# EAGLE design 4th SCHEMATIC_EP (EAGLE 9.6.2)
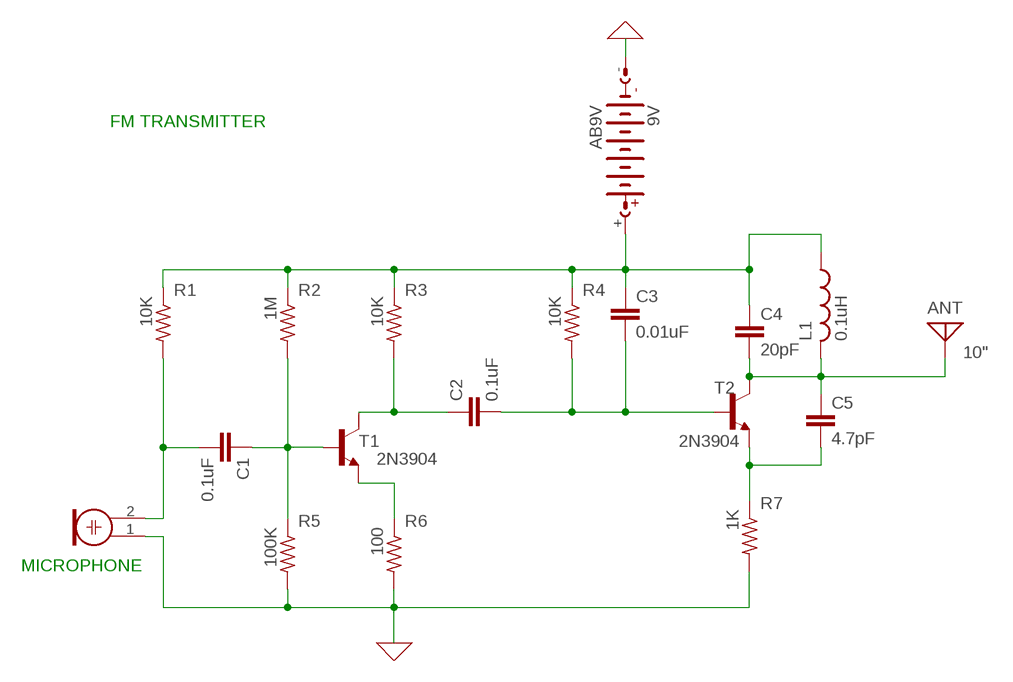
[diagram p0: schematic, sheet 1]

## Parts
9V  AB9V  [AB9V]
ANT  10"  ANTENNA  [PAD-01]
C1  0.1uF  C2.5/2  [C2.5-2]
C2  0.1uF  C2.5/2  [C2.5-2]
C3  0.01uF  C2.5/2  [C2.5-2]
C4  20pF  C2.5/2  [C2.5-2]
C5  4.7pF  C2.5/2  [C2.5-2]
L1  0.1uH  L-US0207/7  [0207/7]
MIC  ELECTRET_MICROPHON-F6050AP  [F6050AP]
R1  10K  R-US_R0603  [R0603]
R2  1M  R-US_R0603  [R0603]
R3  10K  R-US_R0603  [R0603]
R4  10K  R-US_R0603  [R0603]
R5  100K  R-US_R0603  [R0603]
R6  100  R-US_R0603  [R0603]
R7  1K  R-US_R0603  [R0603]
T1  2N3904  [TO92]
T2  2N3904  [TO92]

## Nets
0: 9V.- MIC.1 R5.2 R6.2 R7.2 ; supply symbol labelled GND
N$1: C1.1 R2.2 R5.1 T1.2(B)
N$2: R6.1 T1.3(E)
N$3: C2.1 R3.2 T1.1(C)
N$4: 9V.+ C3.1 C4.1 L1.1 R1.1 R2.1 R3.1 R4.1
N$5: C1.2 MIC.2 R1.2
N$7: C5.2 R7.1 T2.3(E)
N$8: C2.2 C3.2 R4.2 T2.2(B)
N$9: ANT.1 C4.2 C5.1 L1.2 T2.1(C)

## Notes on the sheet
- FM TRANSMITTER
- MICROPHONE

## Library data of the parts
9V = battery:AB9V: 9-V BATTERY CLIP
ANT = discrete:ANTENNA: Antenna
C1-C5 = capacitor-wima:C: CAPACITOR naming: grid - package width
L1 = rcl:L-US: INDUCTOR, American symbol; SPICEPREFIX: L
MIC = microphon:ELECTRET_MICROPHON-: Electret Condenser Microphone
R1-R7 = rcl:R-US_: RESISTOR, American symbol; SPICEPREFIX: R
T1 T2 = transistor:2N3904: NPN TRANSISTOR

## Board
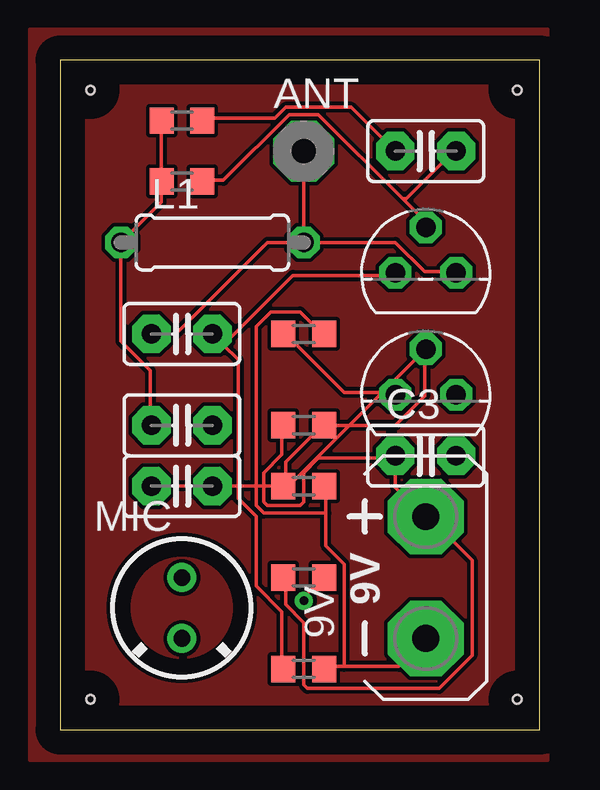
[diagram p1: board, top side]
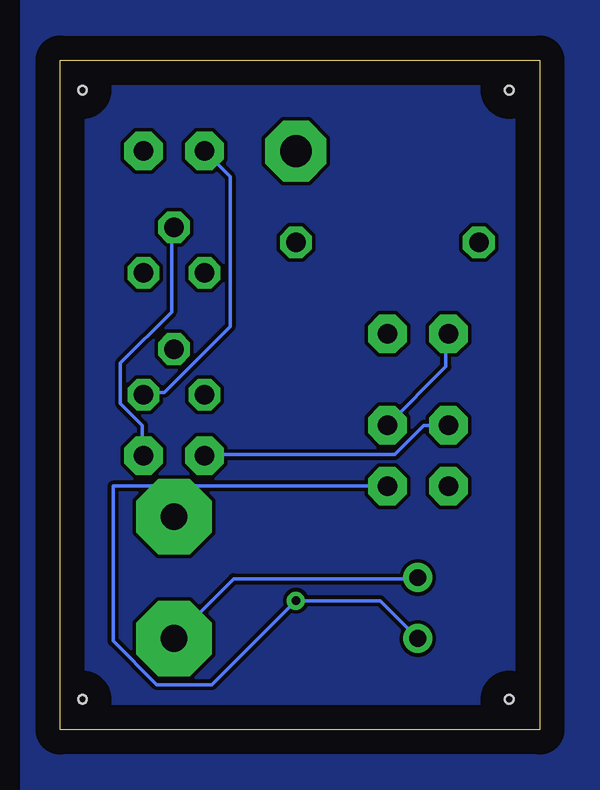
[diagram p2: board, bottom side, seen from below]

Size 19.99 x 27.93 mm. Coordinates in mm from the lower left corner, seen from the top.
Outline: 0,0 19.99,0 19.99,27.93 0,27.93 0,0
Copper layers (1*16): Top 0.035mm / dielectric 1.5mm / Bottom 0.035mm
Design rules "default": minimum track width 6mil, minimum drill 0.35mm, track to track 6mil, track to pad 6mil, pad to pad 6mil, via to via 6mil, smd to smd 6mil, copper to edge 40mil, drill to drill 6mil, minimum pad ring 10mil, minimum via ring 8mil, stop-mask expansion 4mil, vias tented up to drill 0mil, thermal gap 10mil
Holes 0.35 mm at 1.27,26.67 19.05,26.67 19.05,1.27 1.27,1.27

### Footprints (pad centres in the part's own frame; a part is rotated, then mirrored left to right if it is on the bottom)
AB9V = drill 1.118 pad 3.15 octagon: + 0,2.54; - 0,-2.54
PAD-01 = drill 1.321 pad 2.54 octagon: 1 0,0
C2.5-2 = drill 0.813 pad 1.6 octagon: 1 -1.27,0; 2 1.27,0
0207/7 = drill 0.813 octagon: 1 -3.81,0; 2 3.81,0
F6050AP = drill 0.7 pad 1.2: 1 0,1.27; 2 0,-1.27
R0603 = smd 1 x 1.1: 1 -0.85,0; 2 0.85,0
TO92 = drill 0.813 octagon: 1 1.27,0; 2 0,1.905; 3 -1.27,0

### Placement (x,y rotation side)
9V  15.24,6.35 0 top
ANT  10.16,24.13 0 top
C1  5.08,10.16 0 top
C2  15.24,24.13 0 top
C3  15.24,11.43 0 top
C4  5.08,12.7 0 top
C5  5.08,16.51 0 top
L1  6.35,20.32 0 top
MIC  5.08,5.08 0 top
R1  10.16,6.35 0 top
R2  10.16,12.7 0 top
R3  5.08,25.4 0 top
R4  5.08,22.86 0 top
R5  10.16,10.16 0 top
R6  10.16,16.51 0 top
R7  10.16,2.54 0 top
T1  15.24,13.97 0 top
T2  15.24,19.05 0 top

### Tracks (layer width: path | path; a pad name or v marks a point on that pad's centre or on a via)
0
  Top 0.152: 11.84,2.64 14.12,2.64 15.19,3.71 9V.- | 11.84,2.64 11.07,2.64 R7.2 | 11.07,9.04 11.07,7.67 11.84,6.91 11.84,2.64 | 11.07,9.04 11.07,10.11 R5.2 | 11.07,9.04 8.48,9.04 8.18,9.35 8.18,16.82 8.79,17.42 10.01,17.42 10.92,16.51 R6.2
  Bottom 0.152: 9V.- 12.75,6.3 5.13,6.3 MIC.1
GND
  pour Top: -1.27,29.21 -1.27,-1.27 20.32,-1.27 20.32,29.21
  pour Bottom: -2.54,30.48 -2.54,-2.54 21.59,-2.54 21.59,30.48
N$1
  Top 0.152: R5.1 9.4,10.26 9.4,11.18 10.92,12.7 R2.2 13.97,12.7 15.19,13.92 15.19,15.75 T1.2 9.53,10.16 C1.1
N$2
  Top 0.152: R6.1 9.4,16.51 11.84,14.07 13.97,14.07 T1.3
N$3
  Top 0.152: C2.1 12.14,25.96 9.4,25.96 8.94,25.5 6.04,25.5 R3.2
  Bottom 0.152: C2.1 12.9,23.06 12.9,16.82 15.65,14.07 16.41,14.07 T1.1
N$4
  Top 0.152: R3.1 4.22,25.35 4.22,22.91 R4.1 4.22,22.76 4.22,22 L1.1 2.54,16.21 3.76,14.99 3.76,12.7 C4.1 | 13.97,11.33 10.77,11.33 10.16,10.72 10.16,9.5 10.01,9.35 8.64,9.35 8.48,9.5 8.48,10.72 9.25,11.48 9.25,12.7 R2.1 | R1.1 9.4,6.3 9.4,5.23 10.16,4.47 10.16,1.88 10.31,1.73 15.8,1.73 17.17,3.1 17.17,7.06 15.34,8.89 9V.+ 15.19,8.89 13.97,10.11 13.97,11.33 | 13.97,11.33 C3.1
  Bottom 0.152: C4.1 4.83,12.7 6.04,11.48 13.97,11.48 C3.1
N$5  (via drill 0.35)
  Top 0.152: v10.16,5.38 10.16,5.54 10.92,6.3 R1.2
  Bottom 0.152: MIC.2 6.65,5.38 v10.16,5.38 13.67,1.88 15.95,1.88 17.78,3.71 17.78,10.16 C1.2
N$7
  Top 0.152: 6.81,16.05 7.42,15.44 7.42,9.65 8.18,8.89 8.18,5.99 9.25,4.93 9.25,2.64 R7.1 | 6.81,16.05 9.7,18.95 13.97,18.95 T2.3 | 6.81,16.05 C5.2
N$8
  Top 0.152: 14.28,22.15 15.34,21.08 T2.2 | 14.28,22.15 10.77,25.65 9.55,25.65 6.81,22.91 6.04,22.91 R4.2 | 14.28,22.15 14.43,22.15 16.41,24.13 C2.2
  Bottom 0.152: C3.2 16.56,11.48 16.56,12.7 17.48,13.61 17.48,15.29 15.34,17.42 15.34,20.93 T2.2
N$9
  Top 0.152: ANT.1 L1.2 | L1.2 13.97,20.32 15.19,19.1 16.41,19.1 T2.1 | C5.1 4.83,16.51 8.64,20.32 L1.2
  Bottom 0.152: C4.2 3.91,15.14 3.91,16.51 C5.1